# Altium project GSENSE2020BSI.PrjPCB
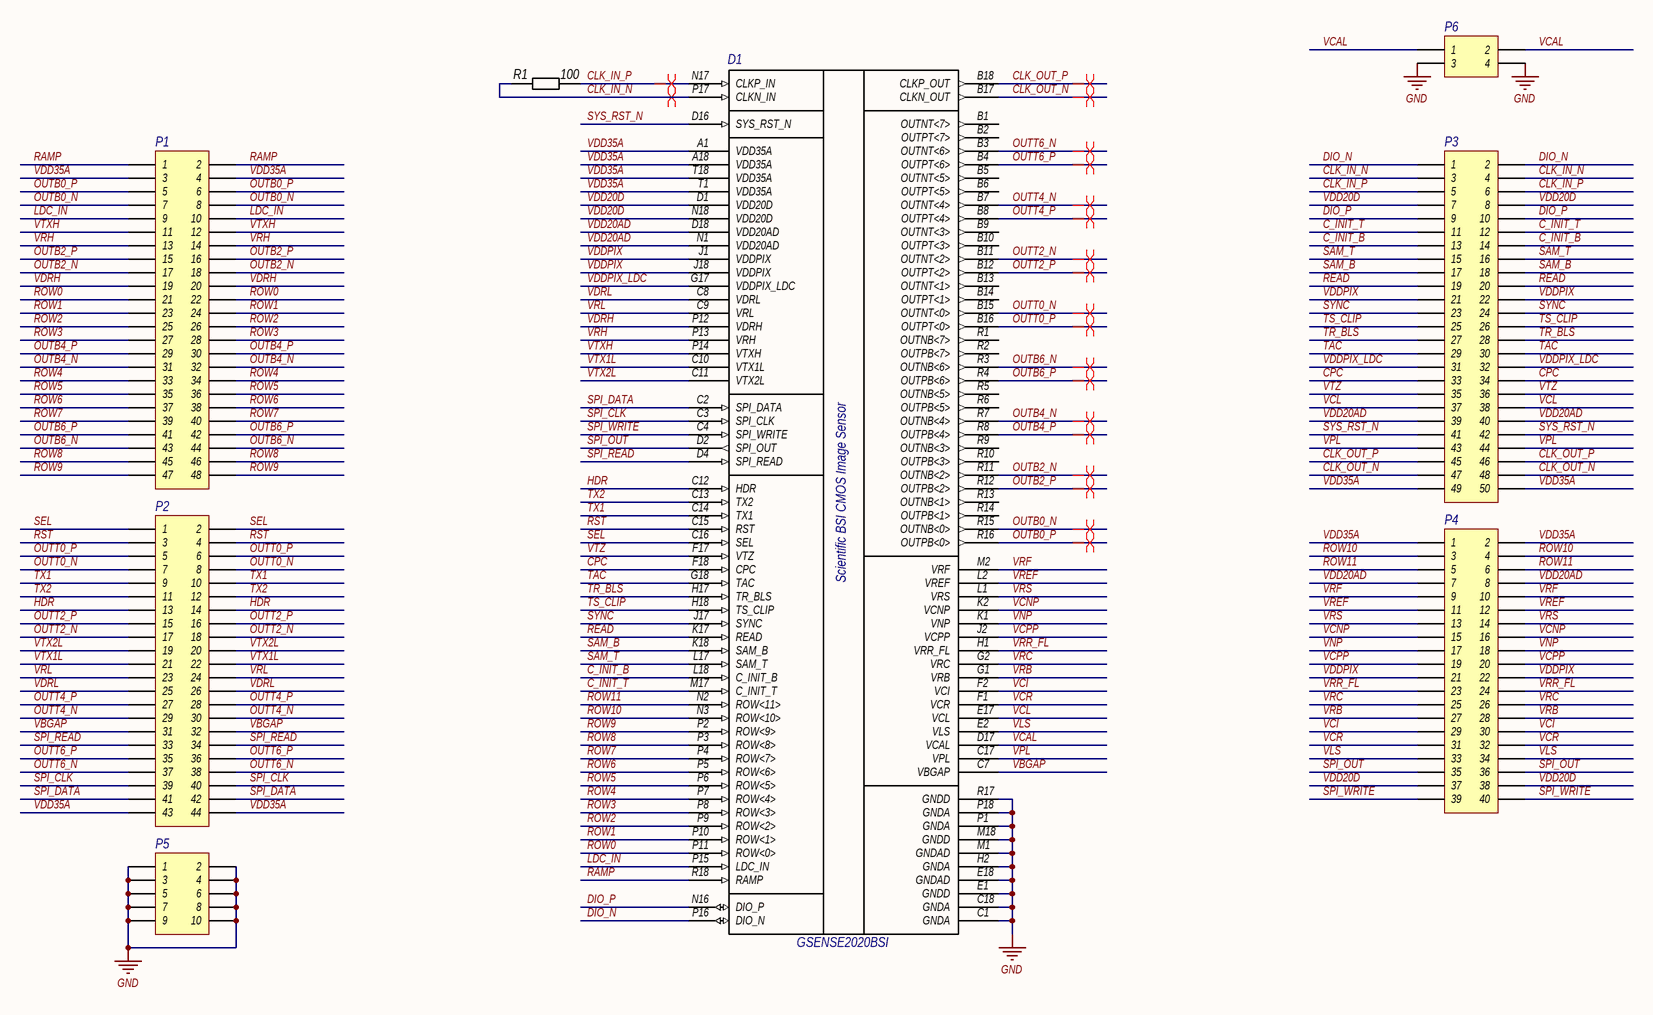
[diagram p0: Sheet_MEZ.SchDoc]
1 sheet, 8 parts. Net scope: global (net labels, ports and power ports of the same name join across sheets).
Board file: PCB_MEZ.PcbDoc

## Sheet Sheet_MEZ.SchDoc
size A3

### Parts
D1  GSENSE2020BSI  [GSENSE2020BSI]
P1  Header 24X2  [HDR2X24]  (value not drawn)
P2  Header 22X2  [HDR2X22]  (value not drawn)
P3  Header 25X2  [HDR2X25]  (value not drawn)
P4  Header 20X2  [HDR2X20]  (value not drawn)
P5  Header 5X2  [HDR2X5]  (value not drawn)
P6  Header 2X2  [HDR2X2]  (value not drawn)
R1  100  [RES]

### Nets
GND: D1.C1(GNDA) D1.C18(GNDA) D1.E1(GNDD) D1.E18(GNDAD) D1.H2(GNDA) D1.M1(GNDAD) D1.M18(GNDD) D1.P1(GNDA) D1.P18(GNDA) D1.R17(GNDD) P5.1 P5.2 P5.3 P5.4 P5.5 P5.6 P5.7 P5.8 P5.9 P5.10 P6.3 P6.4
C_INIT_B: D1.L18(C_INIT_B) P3.13 P3.14
C_INIT_T: D1.M17(C_INIT_T) P3.11 P3.12
CLK_IN_N: D1.P17(CLKN_IN) P3.3 P3.4 R1.1
CLK_IN_P: D1.N17(CLKP_IN) P3.5 P3.6 R1.2
CLK_OUT_N: D1.B17(CLKN_OUT) P3.47 P3.48
CLK_OUT_P: D1.B18(CLKP_OUT) P3.45 P3.46
CPC: D1.F18(CPC) P3.33 P3.34
DIO_N: D1.P16(DIO_N) P3.1 P3.2
DIO_P: D1.N16(DIO_P) P3.9 P3.10
HDR: D1.C12(HDR) P2.13 P2.14
LDC_IN: D1.P15(LDC_IN) P1.9 P1.10
OUTB0_N: D1.R15(OUTNB<0>) P1.7 P1.8
OUTB0_P: D1.R16(OUTPB<0>) P1.5 P1.6
OUTB2_N: D1.R11(OUTNB<2>) P1.17 P1.18
OUTB2_P: D1.R12(OUTPB<2>) P1.15 P1.16
OUTB4_N: D1.R7(OUTNB<4>) P1.31 P1.32
OUTB4_P: D1.R8(OUTPB<4>) P1.29 P1.30
OUTB6_N: D1.R3(OUTNB<6>) P1.43 P1.44
OUTB6_P: D1.R4(OUTPB<6>) P1.41 P1.42
OUTT0_N: D1.B15(OUTNT<0>) P2.7 P2.8
OUTT0_P: D1.B16(OUTPT<0>) P2.5 P2.6
OUTT2_N: D1.B11(OUTNT<2>) P2.17 P2.18
OUTT2_P: D1.B12(OUTPT<2>) P2.15 P2.16
OUTT4_N: D1.B7(OUTNT<4>) P2.29 P2.30
OUTT4_P: D1.B8(OUTPT<4>) P2.27 P2.28
OUTT6_N: D1.B3(OUTNT<6>) P2.37 P2.38
OUTT6_P: D1.B4(OUTPT<6>) P2.35 P2.36
RAMP: D1.R18(RAMP) P1.1 P1.2
READ: D1.K17(READ) P3.19 P3.20
ROW0: D1.P11(ROW<0>) P1.21 P1.22
ROW1: D1.P10(ROW<1>) P1.23 P1.24
ROW2: D1.P9(ROW<2>) P1.25 P1.26
ROW3: D1.P8(ROW<3>) P1.27 P1.28
ROW4: D1.P7(ROW<4>) P1.33 P1.34
ROW5: D1.P6(ROW<5>) P1.35 P1.36
ROW6: D1.P5(ROW<6>) P1.37 P1.38
ROW7: D1.P4(ROW<7>) P1.39 P1.40
ROW8: D1.P3(ROW<8>) P1.45 P1.46
ROW9: D1.P2(ROW<9>) P1.47 P1.48
ROW10: D1.N3(ROW<10>) P4.3 P4.4
ROW11: D1.N2(ROW<11>) P4.5 P4.6
RST: D1.C15(RST) P2.3 P2.4
SAM_B: D1.K18(SAM_B) P3.17 P3.18
SAM_T: D1.L17(SAM_T) P3.15 P3.16
SEL: D1.C16(SEL) P2.1 P2.2
SPI_CLK: D1.C3(SPI_CLK) P2.39 P2.40
SPI_DATA: D1.C2(SPI_DATA) P2.41 P2.42
SPI_OUT: D1.D2(SPI_OUT) P4.35 P4.36
SPI_READ: D1.D4(SPI_READ) P2.33 P2.34
SPI_WRITE: D1.C4(SPI_WRITE) P4.39 P4.40
SYNC: D1.J17(SYNC) P3.23 P3.24
SYS_RST_N: D1.D16(SYS_RST_N) P3.41 P3.42
TAC: D1.G18(TAC) P3.29 P3.30
TR_BLS: D1.H17(TR_BLS) P3.27 P3.28
TS_CLIP: D1.H18(TS_CLIP) P3.25 P3.26
TX1: D1.C14(TX1) P2.9 P2.10
TX2: D1.C13(TX2) P2.11 P2.12
VBGAP: D1.C7(VBGAP) P2.31 P2.32
VCAL: D1.D17(VCAL) P6.1 P6.2
VCI: D1.F2(VCI) P4.29 P4.30
VCL: D1.E17(VCL) P3.37 P3.38
VCNP: D1.K2(VCNP) P4.15 P4.16
VCPP: D1.J2(VCPP) P4.19 P4.20
VCR: D1.F1(VCR) P4.31 P4.32
VDD20AD: D1.D18(VDD20AD) D1.N1(VDD20AD) P3.39 P3.40 P4.7 P4.8
VDD20D: D1.D1(VDD20D) D1.N18(VDD20D) P3.7 P3.8 P4.37 P4.38
VDD35A: D1.A1(VDD35A) D1.A18(VDD35A) D1.T1(VDD35A) D1.T18(VDD35A) P1.3 P1.4 P2.43 P2.44 P3.49 P3.50 P4.1 P4.2
VDDPIX: D1.J1(VDDPIX) D1.J18(VDDPIX) P3.21 P3.22 P4.21 P4.22
VDDPIX_LDC: D1.G17(VDDPIX_LDC) P3.31 P3.32
VDRH: D1.P12(VDRH) P1.19 P1.20
VDRL: D1.C8(VDRL) P2.25 P2.26
VLS: D1.E2(VLS) P4.33 P4.34
VNP: D1.K1(VNP) P4.17 P4.18
VPL: D1.C17(VPL) P3.43 P3.44
VRB: D1.G1(VRB) P4.27 P4.28
VRC: D1.G2(VRC) P4.25 P4.26
VREF: D1.L2(VREF) P4.11 P4.12
VRF: D1.M2(VRF) P4.9 P4.10
VRH: D1.P13(VRH) P1.13 P1.14
VRL: D1.C9(VRL) P2.23 P2.24
VRR_FL: D1.H1(VRR_FL) P4.23 P4.24
VRS: D1.L1(VRS) P4.13 P4.14
VTX1L: D1.C10(VTX1L) P2.21 P2.22
VTX2L: D1.C11(VTX2L) P2.19 P2.20
VTXH: D1.P14(VTXH) P1.11 P1.12
VTZ: D1.F17(VTZ) P3.35 P3.36

Not connected (* = marked no-connect by the designer): D1 B1(OUTNT<7>) B2(OUTPT<7>) B5(OUTNT<5>) B6(OUTPT<5>) B9(OUTNT<3>) B10(OUTPT<3>) B13(OUTNT<1>) B14(OUTPT<1>) R1(OUTNB<7>) R2(OUTPB<7>) R5(OUTNB<5>) R6(OUTPB<5>) R9(OUTNB<3>) R10(OUTPB<3>) R13(OUTNB<1>) R14(OUTPB<1>)

### Layout directives
differential pair: CLK_IN_N, CLK_IN_P, CLK_OUT_N, CLK_OUT_P, OUTB0_N, OUTB0_P, OUTB2_N, OUTB2_P, OUTB4_N, OUTB4_P, OUTB6_N, OUTB6_P, OUTT0_N, OUTT0_P, OUTT2_N, OUTT2_P, OUTT4_N, OUTT4_P, OUTT6_N, OUTT6_P

### Notes on the sheet
- (near D1) Scientific BSI CMOS Image Sensor

### Library data of the parts
P1 = Header 24X2: Header, 24-Pin, Dual row; LatestRevisionDate: 17-Jul-2002; LatestRevisionNote: Re-released for DXP Platform.; Publisher: Altium Limited
P2 = Header 22X2: Header, 22-Pin, Dual row; LatestRevisionDate: 17-Jul-2002; LatestRevisionNote: Re-released for DXP Platform.; Publisher: Altium Limited
P3 = Header 25X2: Header, 25-Pin, Dual row; LatestRevisionDate: 17-Jul-2002; LatestRevisionNote: Re-released for DXP Platform.; Publisher: Altium Limited
P4 = Header 20X2: Header, 20-Pin, Dual row; LatestRevisionDate: 17-Jul-2002; LatestRevisionNote: Re-released for DXP Platform.; Publisher: Altium Limited
P5 = Header 5X2: Header, 5-Pin, Dual row; LatestRevisionDate: 17-Jul-2002; LatestRevisionNote: Re-released for DXP Platform.; Publisher: Altium Limited
P6 = Header 2X2: Header, 2-Pin, Dual row; LatestRevisionDate: 17-Jul-2002; LatestRevisionNote: Re-released for DXP Platform.; Publisher: Altium Limited
R1 = Res: Resistor